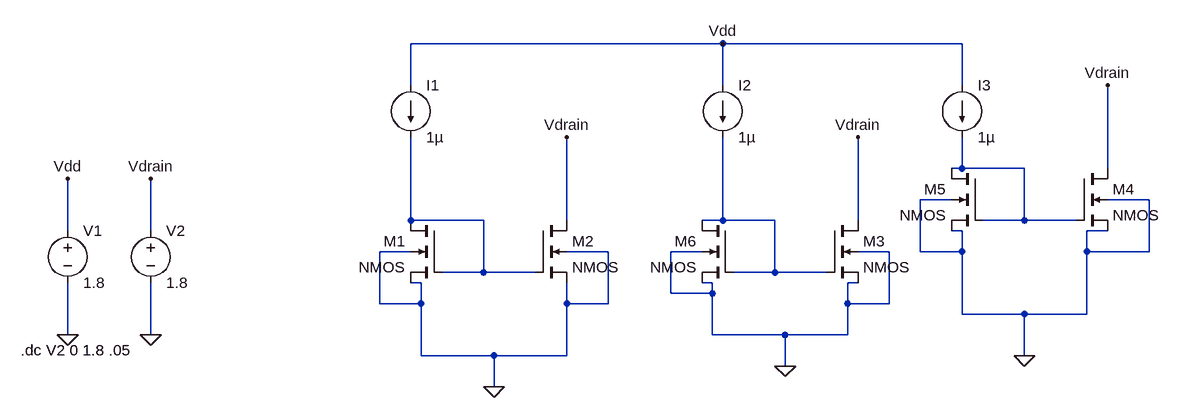
[diagram p0: schematic different lengths.asc]
different lengths.asc, the LTspice schematic file:
Version 4
SHEET 1 1248 680
WIRE 560 -144 80 -144
WIRE 928 -144 560 -144
WIRE 80 -80 80 -144
WIRE 560 -80 560 -144
WIRE 928 -80 928 -144
WIRE 928 48 928 0
WIRE 928 48 912 48
WIRE 1024 48 928 48
WIRE 1152 48 1152 -80
WIRE 912 96 864 96
WIRE 1216 96 1152 96
WIRE 80 128 80 0
WIRE 192 128 80 128
WIRE 320 128 320 0
WIRE 560 128 560 0
WIRE 560 128 528 128
WIRE 640 128 560 128
WIRE 768 128 768 0
WIRE 1024 128 1024 48
WIRE 1024 128 960 128
WIRE 1104 128 1024 128
WIRE -448 144 -448 64
WIRE -320 144 -320 64
WIRE 928 144 912 144
WIRE 1152 144 1120 144
WIRE 80 176 32 176
WIRE 384 176 320 176
WIRE 528 176 480 176
WIRE 816 176 768 176
WIRE 864 176 864 96
WIRE 928 176 928 144
WIRE 928 176 864 176
WIRE 1120 176 1120 144
WIRE 1216 176 1216 96
WIRE 1216 176 1120 176
WIRE 192 208 192 128
WIRE 192 208 128 208
WIRE 272 208 192 208
WIRE 640 208 640 128
WIRE 640 208 576 208
WIRE 720 208 640 208
WIRE 768 208 752 208
WIRE 96 224 80 224
WIRE 544 224 528 224
WIRE 768 224 752 224
WIRE 480 240 480 176
WIRE 544 240 544 224
WIRE 544 240 480 240
WIRE 32 256 32 176
WIRE 96 256 96 224
WIRE 96 256 32 256
WIRE 320 256 320 224
WIRE 384 256 384 176
WIRE 384 256 320 256
WIRE 752 256 752 224
WIRE 816 256 816 176
WIRE 816 256 752 256
WIRE 928 272 928 176
WIRE 1024 272 928 272
WIRE 1120 272 1120 176
WIRE 1120 272 1024 272
WIRE -448 304 -448 224
WIRE -320 304 -320 224
WIRE 544 304 544 240
WIRE 656 304 544 304
WIRE 752 304 752 256
WIRE 752 304 656 304
WIRE 96 336 96 256
WIRE 208 336 96 336
WIRE 320 336 320 256
WIRE 320 336 208 336
WIRE 1024 336 1024 272
WIRE 656 352 656 304
WIRE 208 384 208 336
FLAG -320 304 0
FLAG -448 304 0
FLAG 208 384 0
FLAG 656 352 0
FLAG 1024 336 0
FLAG -448 64 Vdd
FLAG 560 -144 Vdd
FLAG -320 64 Vdrain
FLAG 320 0 Vdrain
FLAG 768 0 Vdrain
FLAG 1152 -80 Vdrain
SYMBOL current 80 -80 R0
WINDOW 123 0 0 Left 0
WINDOW 39 0 0 Left 0
SYMATTR InstName I1
SYMATTR Value 1µ
SYMBOL voltage -448 128 R0
WINDOW 123 0 0 Left 0
WINDOW 39 0 0 Left 0
SYMATTR InstName V1
SYMATTR Value 1.8
SYMBOL voltage -320 128 R0
WINDOW 123 0 0 Left 0
WINDOW 39 0 0 Left 0
SYMATTR InstName V2
SYMATTR Value 1.8
SYMBOL current 560 -80 R0
WINDOW 123 0 0 Left 0
WINDOW 39 0 0 Left 0
SYMATTR InstName I2
SYMATTR Value 1µ
SYMBOL current 928 -80 R0
WINDOW 123 0 0 Left 0
WINDOW 39 0 0 Left 0
SYMATTR InstName I3
SYMATTR Value 1µ
SYMBOL nmos4 128 128 M0
SYMATTR InstName M1
SYMATTR Value2 l=1u w=1u m=1
SYMBOL nmos4 272 128 R0
SYMATTR InstName M2
SYMATTR Value2 l=1u w=1u m=1
SYMBOL nmos4 720 128 R0
SYMATTR InstName M3
SYMATTR Value2 l=4u w=1u m=1
SYMBOL nmos4 1104 48 R0
SYMATTR InstName M4
SYMATTR Value2 l=16u w=1u m=1
SYMBOL nmos4 960 48 M0
SYMATTR InstName M5
SYMATTR Value2 l=16u w=1u m=1
SYMBOL nmos4 576 128 M0
SYMATTR InstName M6
SYMATTR Value2 l=4u w=1u m=1
TEXT -520 328 Left 2 !.dc V2 0 1.8 .05

The netlist it stands for:
* different lengths.asc
I1 Vdd N002 1µ
V1 Vdd 0 1.8
V2 Vdrain 0 1.8
I2 Vdd N003 1µ
I3 Vdd N001 1µ
M1 N002 N002 0 0 NMOS l=1u w=1u m=1
M2 Vdrain N002 0 0 NMOS l=1u w=1u m=1
M3 Vdrain N003 0 0 NMOS l=4u w=1u m=1
M4 Vdrain N001 0 0 NMOS l=16u w=1u m=1
M5 N001 N001 0 0 NMOS l=16u w=1u m=1
M6 N003 N003 0 0 NMOS l=4u w=1u m=1
.model NMOS NMOS
.model PMOS PMOS
.lib standard.mos
.dc V2 0 1.8 .05
.backanno
.end

* Results of the author's LTspice run, read from the files saved beside the schematic
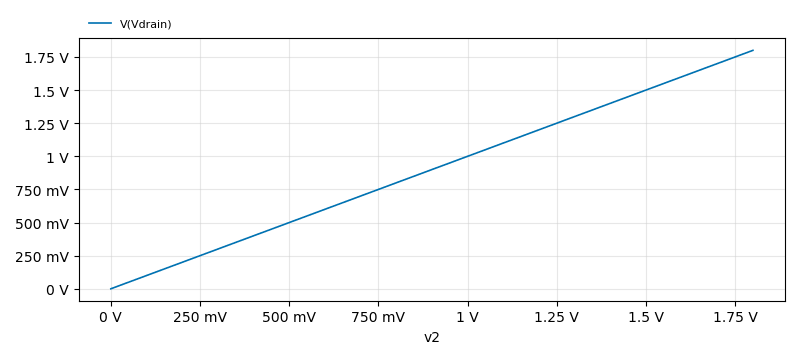
[diagram p1: DC transfer characteristic of different lengths.asc, plotted from the saved traces]
* DC transfer characteristic, 1 run:
*   V(Vdrain): 0 V at v2=0 V, 1.8 V at v2=1.8 V, min 0 V, max 1.8 V